# Altium schematic sheet 02) Block Diagram.SchDoc
size C; SheetTitle: **; CompanyName: Microchip Technology Inc.; Organization: Microchip Technology; Address1: 2355 West Chandler Blvd.; Address2: Chandler, AZ  85224; Address4: USA; DocumentNumber: 2; SheetNumber: 2; SheetTotal: 9; Time: Time
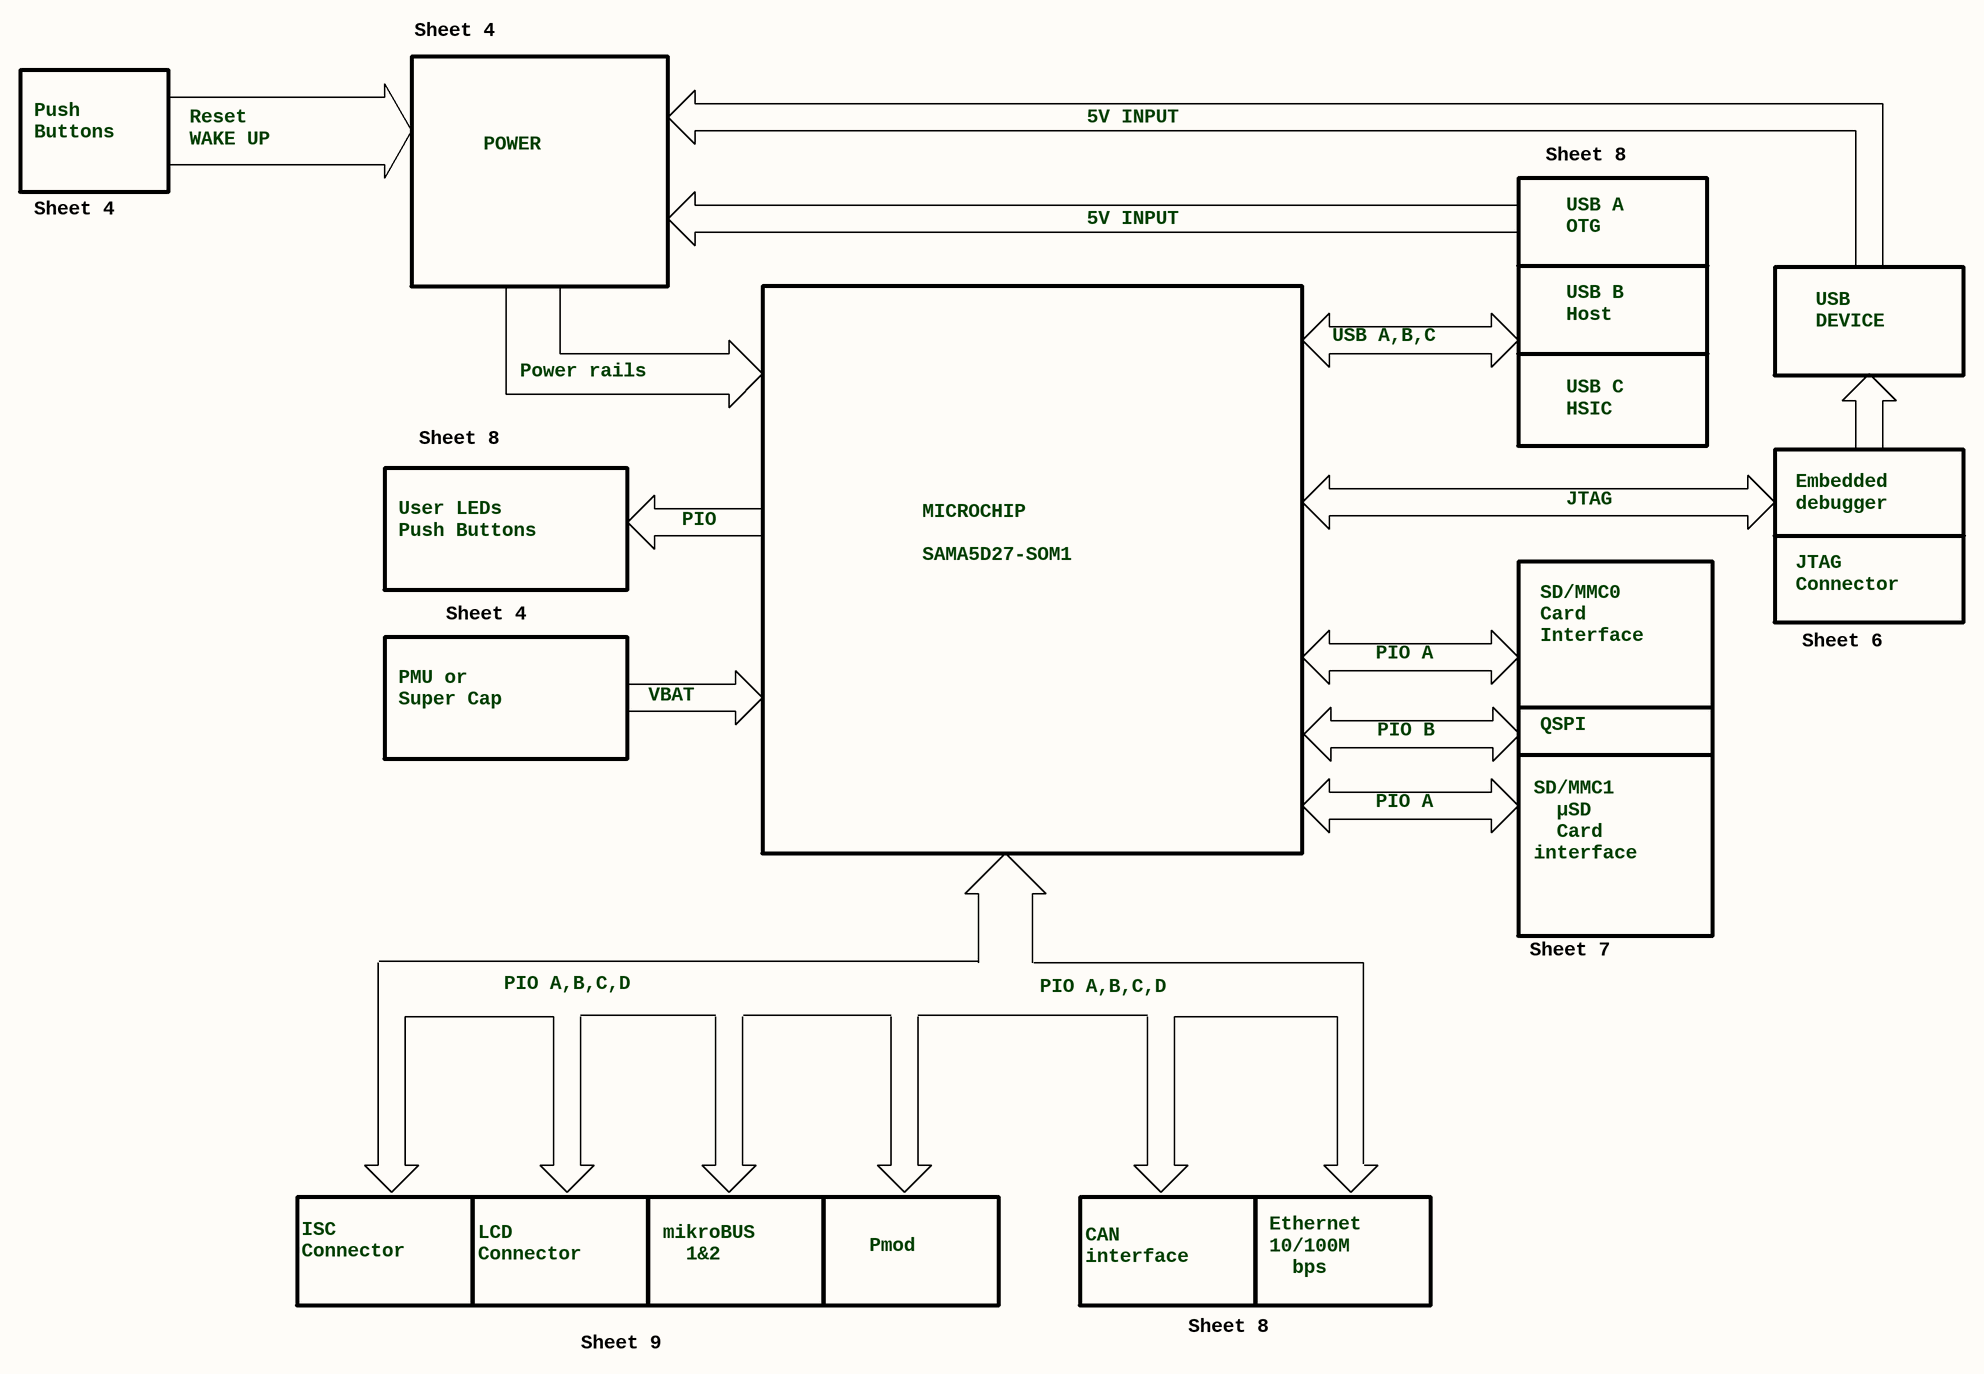
[diagram p0: 02) Block Diagram.SchDoc]

## Parts
?  (no value)  (graphical)

## Notes on the sheet
- Sheet 4
- Push
  Buttons
- Reset
  WAKE UP
- POWER
- 5V INPUT
- Sheet 8
- USB A
  OTG
- USB A,B,C
- USB B
  Host
- USB
  DEVICE
- Power rails
- USB C
  HSIC
- User LEDs
  Push Buttons
- PIO
- JTAG
- Embedded
  debugger
- JTAG
  Connector
- MICROCHIP
  SAMA5D27-SOM1
- PIO A
- SD/MMC0
  Card
  Interface
- Sheet 6
- PMU or
  Super Cap
- VBAT
- PIO B
- QSPI
- SD/MMC1
  µSD
  Card
  interface
- Sheet 7
- PIO A,B,C,D
- ISC
  Connector
- LCD
  Connector
- mikroBUS
  1&2
- Pmod
- CAN
  interface
- Ethernet
  10/100M
  bps
- Sheet 9
- Drawn By:
- Sheet Title
- Engineer:
- PartNumber:
- Project Title
- Designed with
- File:
- Size
- C
- Revision:
- Sch #:
- Date:
- Sheet
- Altium.com <http://go.altium.com/MicrochipLandingPage_Evaluation.html>

## Library data of the parts
? = Title Block C